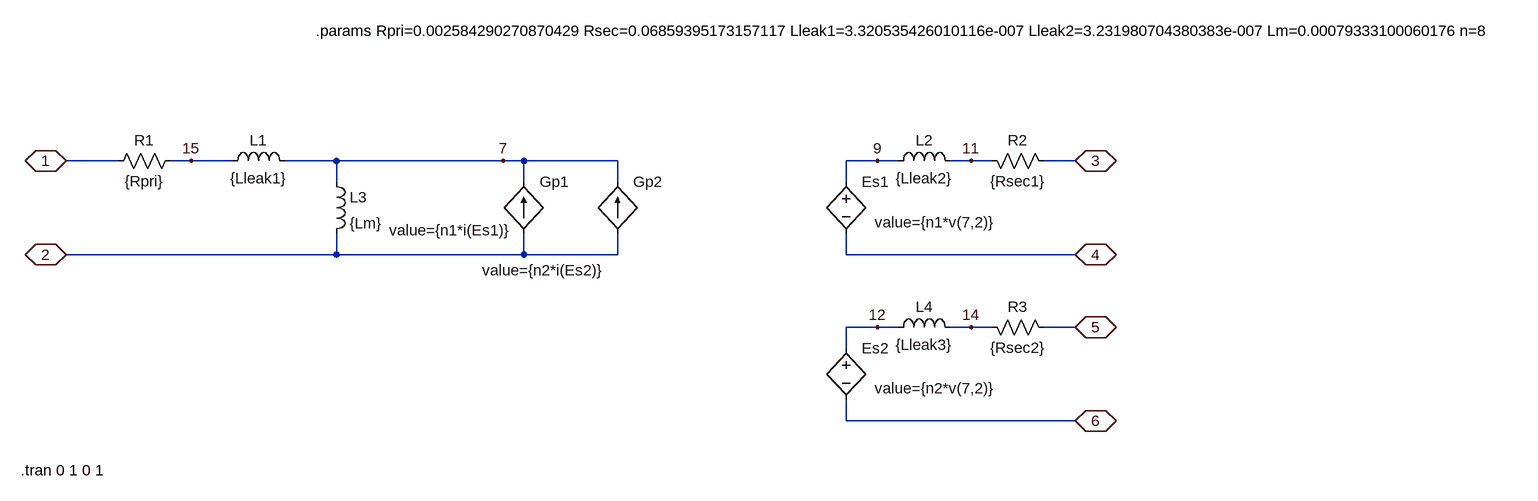
[diagram p0: schematic three_winding_transformer_from_femm.asc]
three_winding_transformer_from_femm.asc, the LTspice schematic file:
Version 4
SHEET 1 1632 680
WIRE -768 112 -848 112
WIRE -656 112 -688 112
WIRE -592 112 -656 112
WIRE -432 112 -512 112
WIRE -176 112 -432 112
WIRE -144 112 -176 112
WIRE 0 112 -144 112
WIRE 400 112 352 112
WIRE 432 112 400 112
WIRE 544 112 512 112
WIRE 576 112 544 112
WIRE 704 112 656 112
WIRE -432 144 -432 112
WIRE -144 144 -144 112
WIRE 0 144 0 112
WIRE 352 144 352 112
WIRE -432 256 -432 224
WIRE -432 256 -848 256
WIRE -144 256 -144 224
WIRE -144 256 -432 256
WIRE 0 256 0 224
WIRE 0 256 -144 256
WIRE 352 256 352 224
WIRE 704 256 352 256
WIRE 400 368 352 368
WIRE 432 368 400 368
WIRE 544 368 512 368
WIRE 576 368 544 368
WIRE 704 368 656 368
WIRE 352 400 352 368
WIRE 352 512 352 480
WIRE 704 512 352 512
FLAG -848 112 1
IOPIN -848 112 BiDir
FLAG -848 256 2
IOPIN -848 256 BiDir
FLAG 704 112 3
IOPIN 704 112 BiDir
FLAG 704 256 4
IOPIN 704 256 BiDir
FLAG -176 112 7
FLAG 400 112 9
FLAG -656 112 15
FLAG 544 112 11
FLAG 704 368 5
IOPIN 704 368 BiDir
FLAG 704 512 6
IOPIN 704 512 BiDir
FLAG 400 368 12
FLAG 544 368 14
SYMBOL res -672 96 R90
WINDOW 0 0 56 VBottom 2
WINDOW 3 32 56 VTop 2
SYMATTR InstName R1
SYMATTR Value {Rpri}
SYMBOL ind -608 128 R270
WINDOW 0 32 56 VTop 2
WINDOW 3 5 56 VBottom 2
SYMATTR InstName L1
SYMATTR Value {Lleak1}
SYMBOL res 560 96 M90
WINDOW 0 0 56 VBottom 2
WINDOW 3 32 56 VTop 2
SYMATTR InstName R2
SYMATTR Value {Rsec1}
SYMBOL ind 528 128 M270
WINDOW 0 32 56 VTop 2
WINDOW 3 5 56 VBottom 2
SYMATTR InstName L2
SYMATTR Value {Lleak2}
SYMBOL bi -144 224 M180
WINDOW 3 -207 5 Left 2
WINDOW 0 24 80 Left 2
SYMATTR Value value={n1*i(Es1)}
SYMATTR InstName Gp1
SYMATTR Prefix G
SYMBOL bv 352 128 R0
WINDOW 3 44 78 Left 2
SYMATTR Value value={n1*v(7,2)}
SYMATTR InstName Es1
SYMATTR Prefix E
SYMBOL ind -448 128 R0
SYMATTR InstName L3
SYMATTR Value {Lm}
SYMBOL res 560 352 M90
WINDOW 0 0 56 VBottom 2
WINDOW 3 32 56 VTop 2
SYMATTR InstName R3
SYMATTR Value {Rsec2}
SYMBOL ind 528 384 M270
WINDOW 0 32 56 VTop 2
WINDOW 3 5 56 VBottom 2
SYMATTR InstName L4
SYMATTR Value {Lleak3}
SYMBOL bv 352 384 R0
WINDOW 3 44 78 Left 2
SYMATTR Value value={n2*v(7,2)}
SYMATTR InstName Es2
SYMATTR Prefix E
SYMBOL bi 0 224 M180
WINDOW 3 -208 -56 Left 2
WINDOW 0 24 80 Left 2
SYMATTR Value value={n2*i(Es2)}
SYMATTR InstName Gp2
SYMATTR Prefix G
TEXT -464 -88 Left 2 !.params Rpri=0.002584290270870429 Rsec=0.06859395173157117 Lleak1=3.320535426010116e-007 Lleak2=3.231980704380383e-007 Lm=0.00079333100060176 n=8
TEXT -918 588 Left 2 !.tran 0 1 0 1

The netlist it stands for:
* three_winding_transformer_from_femm.asc
R1 15 1 {Rpri}
L1 15 7 {Lleak1}
R2 11 3 {Rsec1}
L2 11 9 {Lleak2}
Gp1 2 7 value={n1*i(Es1)}
Es1 9 4 value={n1*v(7,2)}
L3 7 2 {Lm}
R3 14 5 {Rsec2}
L4 14 12 {Lleak3}
Es2 12 6 value={n2*v(7,2)}
Gp2 2 7 value={n2*i(Es2)}
.params Rpri=0.002584290270870429 Rsec=0.06859395173157117 Lleak1=3.320535426010116e-007 Lleak2=3.231980704380383e-007 Lm=0.00079333100060176 n=8
.tran 0 1 0 1
.backanno
.end